# EAGLE schematic SPDTrelay_nice_layout (EAGLE 8.3.2)
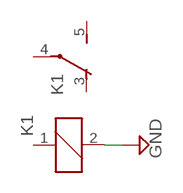
[diagram p0: schematic, sheet 1]

## Parts
K1  HF41F-12-Z  [HF41F-12-Z]

## Nets
GND: K1.2
Unconnected: K1.1 K1.3(2:O) K1.4(2:P) K1.5(2:S)

## Library data of the parts
K1 = relay_computer_custom:HF41F-12-Z: SPDT RELAY Relay SPDT 5mm x 28mm HONGFA